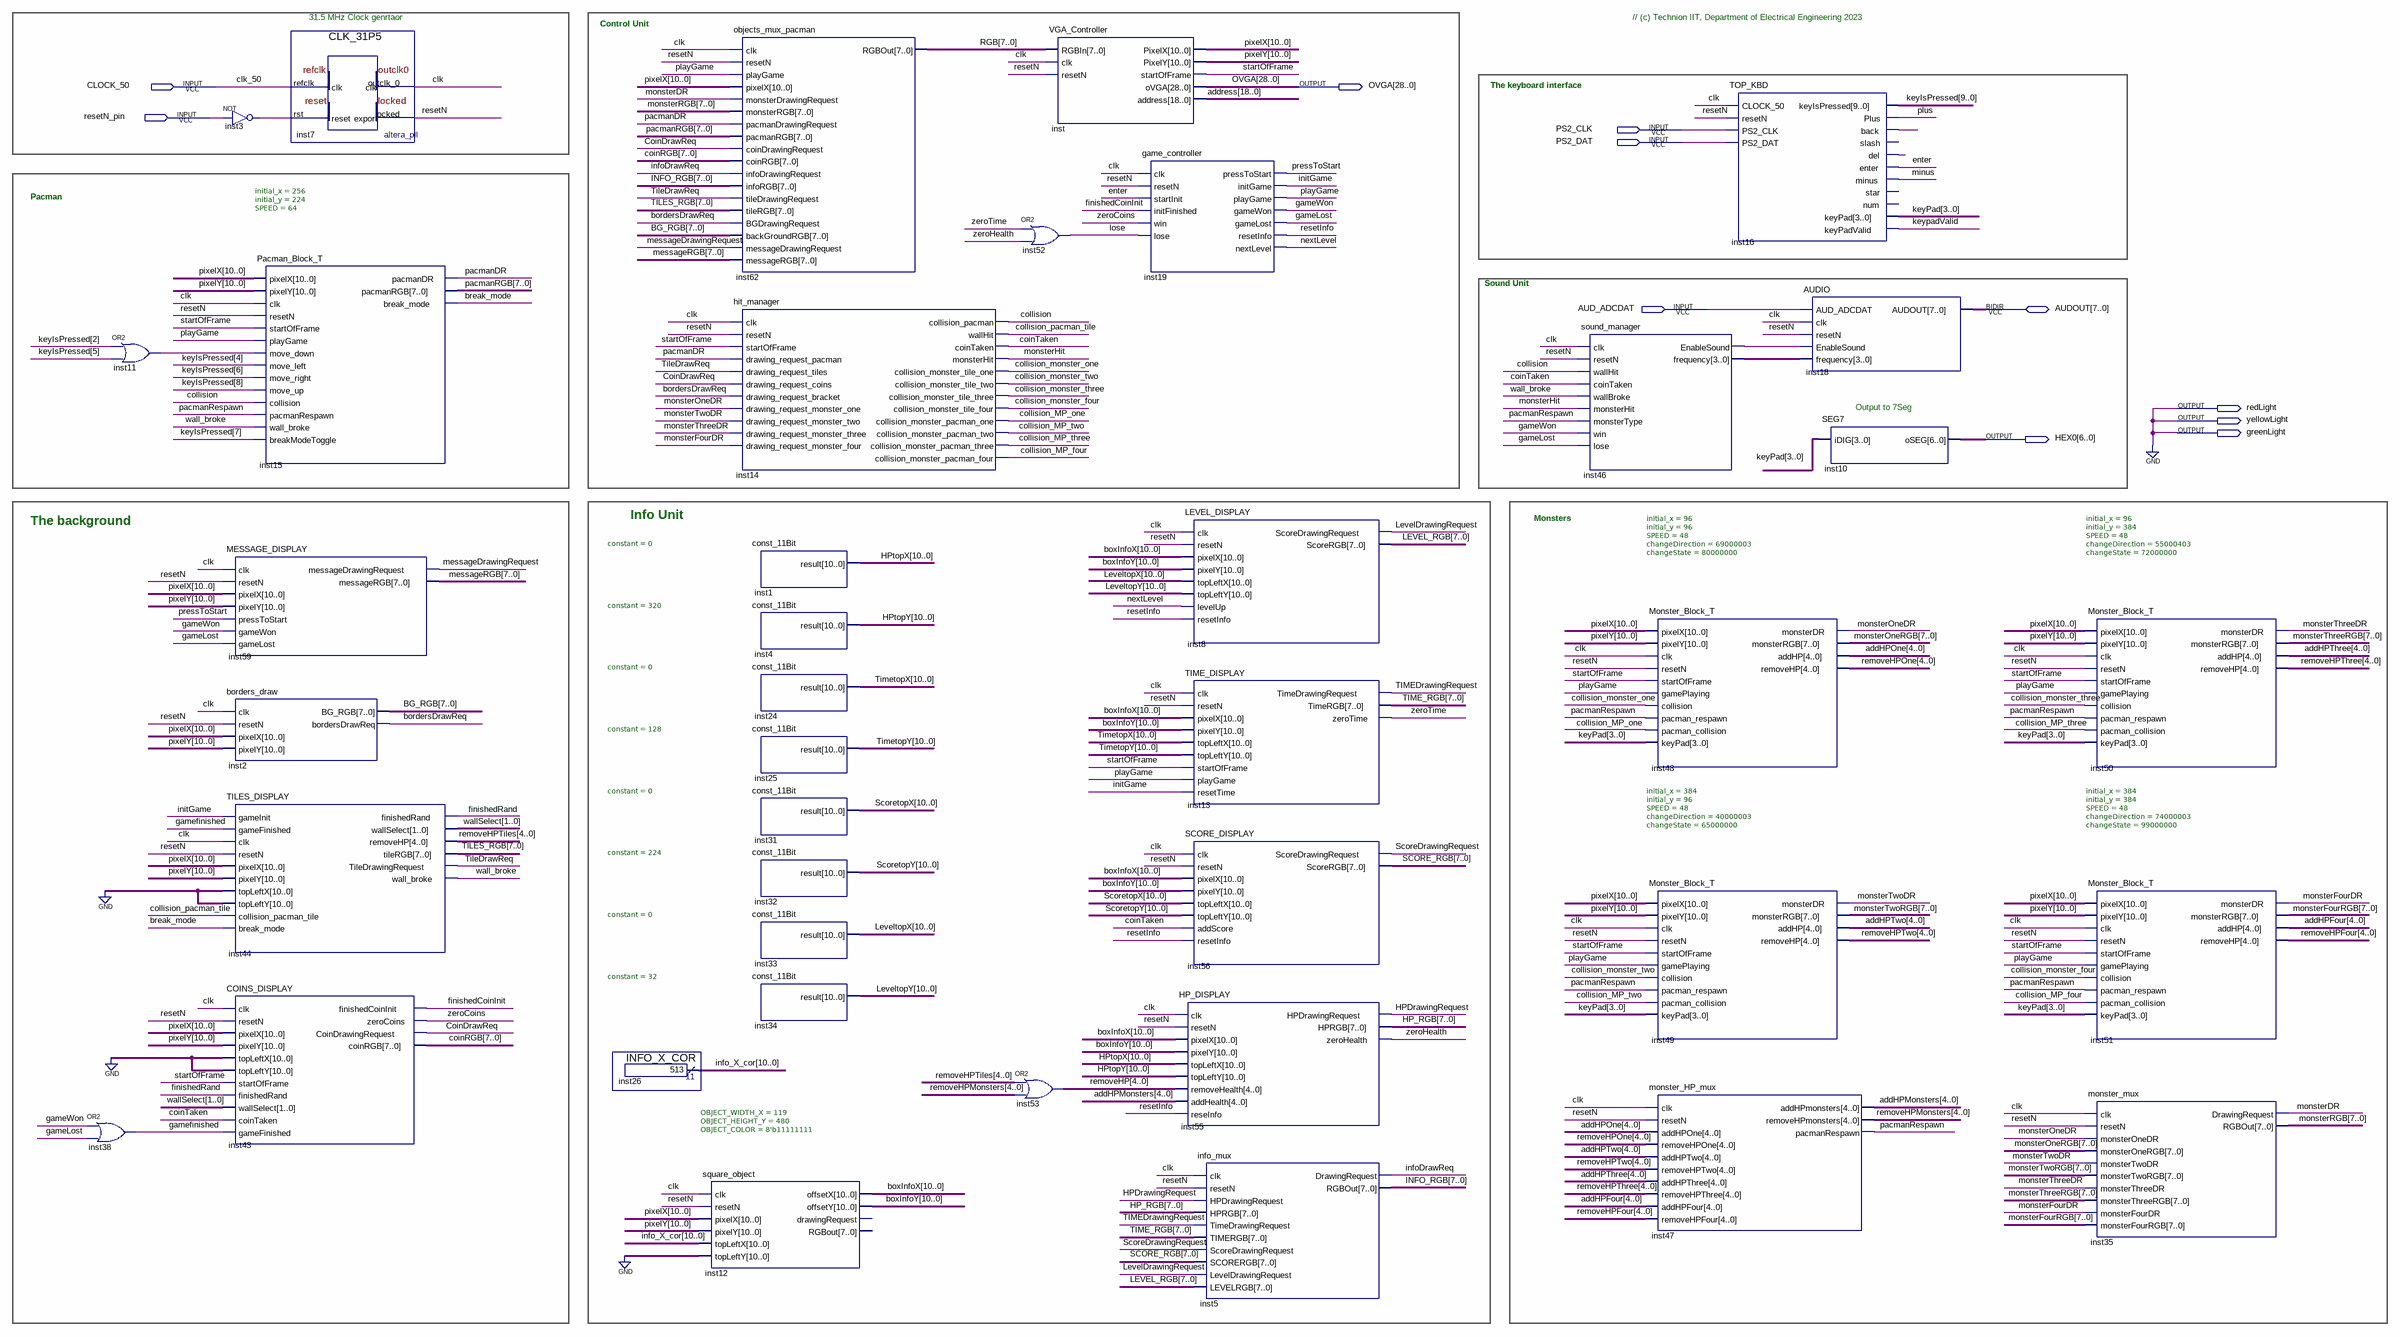
[diagram p0: schematic sheet]
// Quartus schematic TOP_VGA_PROJECT.bdf as structural Verilog: 40 symbols, 11 pins
module TOP_VGA_PROJECT (
  input  CLOCK_50,
  input  resetN_pin,
  input  PS2_CLK,
  input  PS2_DAT,
  input  AUD_ADCDAT,
  inout  [7:0] AUDOUT,
  output [28:0] OVGA,
  output redLight,
  output yellowLight,
  output greenLight,
  output [6:0] HEX0
);

  wire bordersDrawReq, break_mode, clk, CoinDrawReq, coinTaken, collision, collision_monster_four,
       collision_monster_one, collision_monster_three, collision_monster_two, collision_MP_four,
       collision_MP_one, collision_MP_three, collision_MP_two, collision_pacman_tile, enter,
       finishedCoinInit, finishedRand, gamefinished, gameLost, gameWon, HPDrawingRequest, infoDrawReq,
       initGame, inst3_out, inst11_out, inst16_back, inst16_del, inst46_enablesound, keypadValid,
       LevelDrawingRequest, lose, messageDrawingRequest, minus, monsterDR, monsterFourDR, monsterHit,
       monsterOneDR, monsterThreeDR, monsterTwoDR, nextLevel, pacmanDR, pacmanRespawn, playGame, plus,
       pressToStart, resetInfo, resetN, ScoreDrawingRequest, startOfFrame, TileDrawReq, TIMEDrawingRequest,
       wall_broke, zeroCoins, zeroHealth, zeroTime;
  wire [1:0] wallSelect;
  wire [3:0] inst46_frequency, keyPad;
  wire [4:0] addHPFour, addHPMonsters, addHPOne, addHPThree, addHPTwo, removeHP, removeHPFour,
       removeHPMonsters, removeHPOne, removeHPThree, removeHPTiles, removeHPTwo;
  wire [7:0] BG_RGB, coinRGB, HP_RGB, INFO_RGB, LEVEL_RGB, messageRGB, monsterFourRGB, monsterOneRGB,
       monsterRGB, monsterThreeRGB, monsterTwoRGB, pacmanRGB, RGB, SCORE_RGB, TILES_RGB, TIME_RGB;
  wire [9:0] keyIsPressed;
  wire [10:0] boxInfoX, boxInfoY, HPtopX, HPtopY, info_X_cor, LeveltopX, LeveltopY, pixelX, pixelY,
       ScoretopX, ScoretopY, TimetopX, TimetopY;
  wire [18:0] address;

  or inst11 (inst11_out, keyIsPressed[2], keyIsPressed[5]);
  or inst38 (gamefinished, gameWon, gameLost);
  not inst3 (inst3_out, resetN_pin);
  MESSAGE_DISPLAY inst59 (
    .clk(clk), .resetN(resetN), .pixelX(pixelX), .pixelY(pixelY), .pressToStart(pressToStart),
    .gameWon(gameWon), .gameLost(gameLost), .messageDrawingRequest(messageDrawingRequest),
    .messageRGB(messageRGB));
  borders_draw inst2 (
    .clk(clk), .resetN(resetN), .pixelX(pixelX), .pixelY(pixelY), .BG_RGB(BG_RGB),
    .bordersDrawReq(bordersDrawReq));
  TILES_DISPLAY inst44 (
    .gameInit(initGame), .gameFinished(gamefinished), .clk(clk), .resetN(resetN), .pixelX(pixelX),
    .pixelY(pixelY), .topLeftX({11{1'b0}}), .topLeftY({11{1'b0}}),
    .collision_pacman_tile(collision_pacman_tile), .break_mode(break_mode), .finishedRand(finishedRand),
    .wallSelect(wallSelect), .removeHP(removeHPTiles), .tileRGB(TILES_RGB), .TileDrawingRequest(TileDrawReq),
    .wall_broke(wall_broke));
  COINS_DISPLAY inst43 (
    .clk(clk), .resetN(resetN), .pixelX(pixelX), .pixelY(pixelY), .topLeftX({11{1'b0}}),
    .topLeftY({11{1'b0}}), .startOfFrame(startOfFrame), .finishedRand(finishedRand), .wallSelect(wallSelect),
    .coinTaken(coinTaken), .gameFinished(gamefinished), .finishedCoinInit(finishedCoinInit),
    .zeroCoins(zeroCoins), .CoinDrawingRequest(CoinDrawReq), .coinRGB(coinRGB));
  Pacman_Block_T #(.initial_x(256), .initial_y(224), .SPEED(64)) inst15 (
    .pixelX(pixelX), .pixelY(pixelY), .clk(clk), .resetN(resetN), .startOfFrame(startOfFrame),
    .playGame(playGame), .move_down(inst11_out), .move_left(keyIsPressed[4]), .move_right(keyIsPressed[6]),
    .move_up(keyIsPressed[8]), .collision(collision), .pacmanRespawn(pacmanRespawn), .wall_broke(wall_broke),
    .breakModeToggle(keyIsPressed[7]), .pacmanDR(pacmanDR), .pacmanRGB(pacmanRGB), .break_mode(break_mode));
  CLK_31P5 inst7 (.refclk(CLOCK_50), .rst(inst3_out), .outclk_0(clk), .locked(resetN));
  INFO_X_COR inst26 (.result(info_X_cor));
  square_object #(.OBJECT_WIDTH_X(119), .OBJECT_HEIGHT_Y(480), .OBJECT_COLOR(8'b11111111)) inst12 (
    .clk(clk), .resetN(resetN), .pixelX(pixelX), .pixelY(pixelY), .topLeftX(info_X_cor),
    .topLeftY({11{1'b0}}), .offsetX(boxInfoX), .offsetY(boxInfoY));  // open: drawingRequest, RGBout
  objects_mux_pacman inst62 (
    .clk(clk), .resetN(resetN), .playGame(playGame), .pixelX(pixelX), .monsterDrawingRequest(monsterDR),
    .monsterRGB(monsterRGB), .pacmanDrawingRequest(pacmanDR), .pacmanRGB(pacmanRGB),
    .coinDrawingRequest(CoinDrawReq), .coinRGB(coinRGB), .infoDrawingRequest(infoDrawReq),
    .infoRGB(INFO_RGB), .tileDrawingRequest(TileDrawReq), .tileRGB(TILES_RGB),
    .BGDrawingRequest(bordersDrawReq), .backGroundRGB(BG_RGB), .messageDrawingRequest(messageDrawingRequest),
    .messageRGB(messageRGB), .RGBOut(RGB));
  hit_manager inst14 (
    .clk(clk), .resetN(resetN), .startOfFrame(startOfFrame), .drawing_request_pacman(pacmanDR),
    .drawing_request_tiles(TileDrawReq), .drawing_request_coins(CoinDrawReq),
    .drawing_request_bracket(bordersDrawReq), .drawing_request_monster_one(monsterOneDR),
    .drawing_request_monster_two(monsterTwoDR), .drawing_request_monster_three(monsterThreeDR),
    .drawing_request_monster_four(monsterFourDR), .collision_pacman(collision),
    .wallHit(collision_pacman_tile), .coinTaken(coinTaken), .monsterHit(monsterHit),
    .collision_monster_tile_one(collision_monster_one), .collision_monster_tile_two(collision_monster_two),
    .collision_monster_tile_three(collision_monster_three),
    .collision_monster_tile_four(collision_monster_four), .collision_monster_pacman_one(collision_MP_one),
    .collision_monster_pacman_two(collision_MP_two), .collision_monster_pacman_three(collision_MP_three),
    .collision_monster_pacman_four(collision_MP_four));
  const_11Bit #(.constant(0)) inst1 (.result(HPtopX));
  const_11Bit #(.constant(320)) inst4 (.result(HPtopY));
  const_11Bit #(.constant(0)) inst24 (.result(TimetopX));
  const_11Bit #(.constant(128)) inst25 (.result(TimetopY));
  const_11Bit #(.constant(0)) inst31 (.result(ScoretopX));
  const_11Bit #(.constant(224)) inst32 (.result(ScoretopY));
  const_11Bit #(.constant(0)) inst33 (.result(LeveltopX));
  const_11Bit #(.constant(32)) inst34 (.result(LeveltopY));
  or inst52 (lose, zeroTime, zeroHealth);
  assign removeHP = removeHPTiles | removeHPMonsters;  // OR2 inst53, 5 bits wide
  VGA_Controller inst (
    .RGBIn(RGB), .clk(clk), .resetN(resetN), .PixelX(pixelX), .PixelY(pixelY), .startOfFrame(startOfFrame),
    .oVGA(OVGA), .address(address));
  game_controller inst19 (
    .clk(clk), .resetN(resetN), .startInit(enter), .initFinished(finishedCoinInit), .win(zeroCoins),
    .lose(lose), .pressToStart(pressToStart), .initGame(initGame), .playGame(playGame), .gameWon(gameWon),
    .gameLost(gameLost), .resetInfo(resetInfo), .nextLevel(nextLevel));
  LEVEL_DISPLAY inst8 (
    .clk(clk), .resetN(resetN), .pixelX(boxInfoX), .pixelY(boxInfoY), .topLeftX(LeveltopX),
    .topLeftY(LeveltopY), .levelUp(nextLevel), .resetInfo(resetInfo),
    .ScoreDrawingRequest(LevelDrawingRequest), .ScoreRGB(LEVEL_RGB));
  TIME_DISPLAY inst13 (
    .clk(clk), .resetN(resetN), .pixelX(boxInfoX), .pixelY(boxInfoY), .topLeftX(TimetopX),
    .topLeftY(TimetopY), .startOfFrame(startOfFrame), .playGame(playGame), .resetTime(initGame),
    .TimeDrawingRequest(TIMEDrawingRequest), .TimeRGB(TIME_RGB), .zeroTime(zeroTime));
  SCORE_DISPLAY inst56 (
    .clk(clk), .resetN(resetN), .pixelX(boxInfoX), .pixelY(boxInfoY), .topLeftX(ScoretopX),
    .topLeftY(ScoretopY), .addScore(coinTaken), .resetInfo(resetInfo),
    .ScoreDrawingRequest(ScoreDrawingRequest), .ScoreRGB(SCORE_RGB));
  HP_DISPLAY inst55 (
    .clk(clk), .resetN(resetN), .pixelX(boxInfoX), .pixelY(boxInfoY), .topLeftX(HPtopX), .topLeftY(HPtopY),
    .removeHealth(removeHP), .addHealth(addHPMonsters), .reseInfo(resetInfo),
    .HPDrawingRequest(HPDrawingRequest), .HPRGB(HP_RGB), .zeroHealth(zeroHealth));
  info_mux inst5 (
    .clk(clk), .resetN(resetN), .HPDrawingRequest(HPDrawingRequest), .HPRGB(HP_RGB),
    .TimeDrawingRequest(TIMEDrawingRequest), .TIMERGB(TIME_RGB), .ScoreDrawingRequest(ScoreDrawingRequest),
    .SCORERGB(SCORE_RGB), .LevelDrawingRequest(LevelDrawingRequest), .LEVELRGB(LEVEL_RGB),
    .DrawingRequest(infoDrawReq), .RGBOut(INFO_RGB));
  sound_manager inst46 (
    .clk(clk), .resetN(resetN), .wallHit(collision), .coinTaken(coinTaken), .wallBroke(wall_broke),
    .monsterHit(monsterHit), .monsterType(pacmanRespawn), .win(gameWon), .lose(gameLost),
    .EnableSound(inst46_enablesound), .frequency(inst46_frequency));
  Monster_Block_T #(.initial_x(96), .initial_y(96), .SPEED(48), .changeDirection(69000003), .changeState(80000000)) inst48 (
    .pixelX(pixelX), .pixelY(pixelY), .clk(clk), .resetN(resetN), .startOfFrame(startOfFrame),
    .gamePlaying(playGame), .collision(collision_monster_one), .pacman_respawn(pacmanRespawn),
    .pacman_collision(collision_MP_one), .keyPad(keyPad), .monsterDR(monsterOneDR),
    .monsterRGB(monsterOneRGB), .addHP(addHPOne), .removeHP(removeHPOne));
  Monster_Block_T #(.initial_x(384), .initial_y(96), .SPEED(48), .changeDirection(40000003), .changeState(65000000)) inst49 (
    .pixelX(pixelX), .pixelY(pixelY), .clk(clk), .resetN(resetN), .startOfFrame(startOfFrame),
    .gamePlaying(playGame), .collision(collision_monster_two), .pacman_respawn(pacmanRespawn),
    .pacman_collision(collision_MP_two), .keyPad(keyPad), .monsterDR(monsterTwoDR),
    .monsterRGB(monsterTwoRGB), .addHP(addHPTwo), .removeHP(removeHPTwo));
  monster_HP_mux inst47 (
    .clk(clk), .resetN(resetN), .addHPOne(addHPOne), .removeHPOne(removeHPOne), .addHPTwo(addHPTwo),
    .removeHPTwo(removeHPTwo), .addHPThree(addHPThree), .removeHPThree(removeHPThree), .addHPFour(addHPFour),
    .removeHPFour(removeHPFour), .addHPmonsters(addHPMonsters), .removeHPmonsters(removeHPMonsters),
    .pacmanRespawn(pacmanRespawn));
  TOP_KBD inst16 (
    .CLOCK_50(clk), .resetN(resetN), .PS2_CLK(PS2_CLK), .PS2_DAT(PS2_DAT), .keyIsPressed(keyIsPressed),
    .Plus(plus), .back(inst16_back), .del(inst16_del), .enter(enter), .minus(minus), .keyPad(keyPad),
    .keyPadValid(keypadValid));  // open: slash, star, num
  AUDIO inst18 (
    .AUD_ADCDAT(AUD_ADCDAT), .clk(clk), .resetN(resetN), .EnableSound(inst46_enablesound),
    .frequency(inst46_frequency), .AUDOUT(AUDOUT));
  SEG7 inst10 (.iDIG(keyPad), .oSEG(HEX0));
  Monster_Block_T #(.initial_x(96), .initial_y(384), .SPEED(48), .changeDirection(55000403), .changeState(72000000)) inst50 (
    .pixelX(pixelX), .pixelY(pixelY), .clk(clk), .resetN(resetN), .startOfFrame(startOfFrame),
    .gamePlaying(playGame), .collision(collision_monster_three), .pacman_respawn(pacmanRespawn),
    .pacman_collision(collision_MP_three), .keyPad(keyPad), .monsterDR(monsterThreeDR),
    .monsterRGB(monsterThreeRGB), .addHP(addHPThree), .removeHP(removeHPThree));
  Monster_Block_T #(.initial_x(384), .initial_y(384), .SPEED(48), .changeDirection(74000003), .changeState(99000000)) inst51 (
    .pixelX(pixelX), .pixelY(pixelY), .clk(clk), .resetN(resetN), .startOfFrame(startOfFrame),
    .gamePlaying(playGame), .collision(collision_monster_four), .pacman_respawn(pacmanRespawn),
    .pacman_collision(collision_MP_four), .keyPad(keyPad), .monsterDR(monsterFourDR),
    .monsterRGB(monsterFourRGB), .addHP(addHPFour), .removeHP(removeHPFour));
  monster_mux inst35 (
    .clk(clk), .resetN(resetN), .monsterOneDR(monsterOneDR), .monsterOneRGB(monsterOneRGB),
    .monsterTwoDR(monsterTwoDR), .monsterTwoRGB(monsterTwoRGB), .monsterThreeDR(monsterThreeDR),
    .monsterThreeRGB(monsterThreeRGB), .monsterFourDR(monsterFourDR), .monsterFourRGB(monsterFourRGB),
    .DrawingRequest(monsterDR), .RGBOut(monsterRGB));

  assign greenLight = 1'b0;
  assign redLight = 1'b0;
  assign yellowLight = 1'b0;

  // Other names for the same wires on the sheet: clk_50 = CLOCK_50

  // Notes on the sheet:
  //   31.5 MHz Clock genrtaor
  //   // (c) Technion IIT, Department of Electrical Engineering 2023
  //   Control Unit
  //   The keyboard interface
  //   Pacman
  //   Sound Unit
  //   Output to 7Seg
  //   Info Unit
  //   The background
  //   Monsters
endmodule
